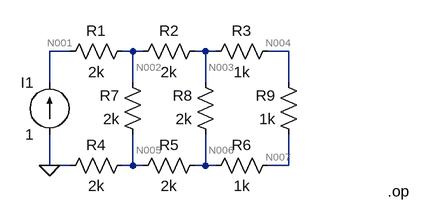
[diagram p0: schematic Lab03_02b.asc]
Lab03_02b.asc, the LTspice schematic file:
Version 4
SHEET 1 992 680
WIRE 464 128 432 128
WIRE 560 128 544 128
WIRE 576 128 560 128
WIRE 672 128 656 128
WIRE 688 128 672 128
WIRE 800 128 768 128
WIRE 432 176 432 128
WIRE 560 176 560 128
WIRE 672 176 672 128
WIRE 800 176 800 128
WIRE 432 304 432 256
WIRE 464 304 432 304
WIRE 560 304 560 256
WIRE 560 304 544 304
WIRE 576 304 560 304
WIRE 672 304 672 256
WIRE 672 304 656 304
WIRE 688 304 672 304
WIRE 800 304 800 256
WIRE 800 304 768 304
FLAG 432 304 0
DATAFLAG 432 128 ""
SYMBOL current 432 256 R180
WINDOW 0 24 80 Left 2
WINDOW 3 24 0 Left 2
SYMATTR InstName I1
SYMATTR Value 1
SYMBOL res 560 112 R90
WINDOW 0 0 56 VBottom 2
WINDOW 3 32 56 VTop 2
SYMATTR InstName R1
SYMATTR Value 2k
SYMBOL res 672 112 R90
WINDOW 0 0 56 VBottom 2
WINDOW 3 32 56 VTop 2
SYMATTR InstName R2
SYMATTR Value 2k
SYMBOL res 784 112 R90
WINDOW 0 0 56 VBottom 2
WINDOW 3 32 56 VTop 2
SYMATTR InstName R3
SYMATTR Value 1k
SYMBOL res 560 288 R90
WINDOW 0 0 56 VBottom 2
WINDOW 3 32 56 VTop 2
SYMATTR InstName R4
SYMATTR Value 2k
SYMBOL res 672 288 R90
WINDOW 0 0 56 VBottom 2
WINDOW 3 32 56 VTop 2
SYMATTR InstName R5
SYMATTR Value 2k
SYMBOL res 784 288 R90
WINDOW 0 0 56 VBottom 2
WINDOW 3 32 56 VTop 2
SYMATTR InstName R6
SYMATTR Value 1k
SYMBOL res 576 272 R180
WINDOW 0 36 76 Left 2
WINDOW 3 36 40 Left 2
SYMATTR InstName R7
SYMATTR Value 2k
SYMBOL res 688 272 R180
WINDOW 0 36 76 Left 2
WINDOW 3 36 40 Left 2
SYMATTR InstName R8
SYMATTR Value 2k
SYMBOL res 816 272 R180
WINDOW 0 36 76 Left 2
WINDOW 3 36 40 Left 2
SYMATTR InstName R9
SYMATTR Value 1k
TEXT 952 344 Left 2 !.op

The netlist it stands for:
* Lab03_02b.asc
I1 0 N001 1
R1 N002 N001 2k
R2 N003 N002 2k
R3 N004 N003 1k
R4 N005 0 2k
R5 N006 N005 2k
R6 N007 N006 1k
R7 N005 N002 2k
R8 N006 N003 2k
R9 N007 N004 1k
.op
.backanno
.end

* Results of the author's LTspice run, read from the files saved beside the schematic
* Operating Point:
*   V(n001) = 5.444 kV
*   V(n002) = 3.444 kV
*   V(n003) = 2.889 kV
*   V(n004) = 2.778 kV
*   V(n005) = 2 kV
*   V(n006) = 2.556 kV
*   V(n007) = 2.667 kV
*   I(I1) = 1 A
*   I(R1) = -1 A
*   I(R2) = -277.8 mA
*   I(R3) = -111.1 mA
*   I(R4) = 1 A
*   I(R5) = 277.8 mA
*   I(R6) = 111.1 mA
*   I(R7) = -722.2 mA
*   I(R8) = -166.7 mA
*   I(R9) = -111.1 mA